# Altium schematic sheet SMA.SchDoc: 8x8 Cross-point
size A3; Author: M.Beldyga; CompanyName: WUT ISE; DrawnBy: M.Beldyga; Organization: WUT ISE; Address1: PW ISE; Address2: Nowowiejska 15/19 00-665 Warsaw; Address3: micbeldyga@gmail.com; SheetNumber: 1; SheetTotal: 1; ModifiedBy: -; CheckedDate: -; Title2: SMA mezzanine; DivGrp: WUT ISE; Designer: M.Beldyga; ModifiedDate: -; ProjectName: Sensor Box
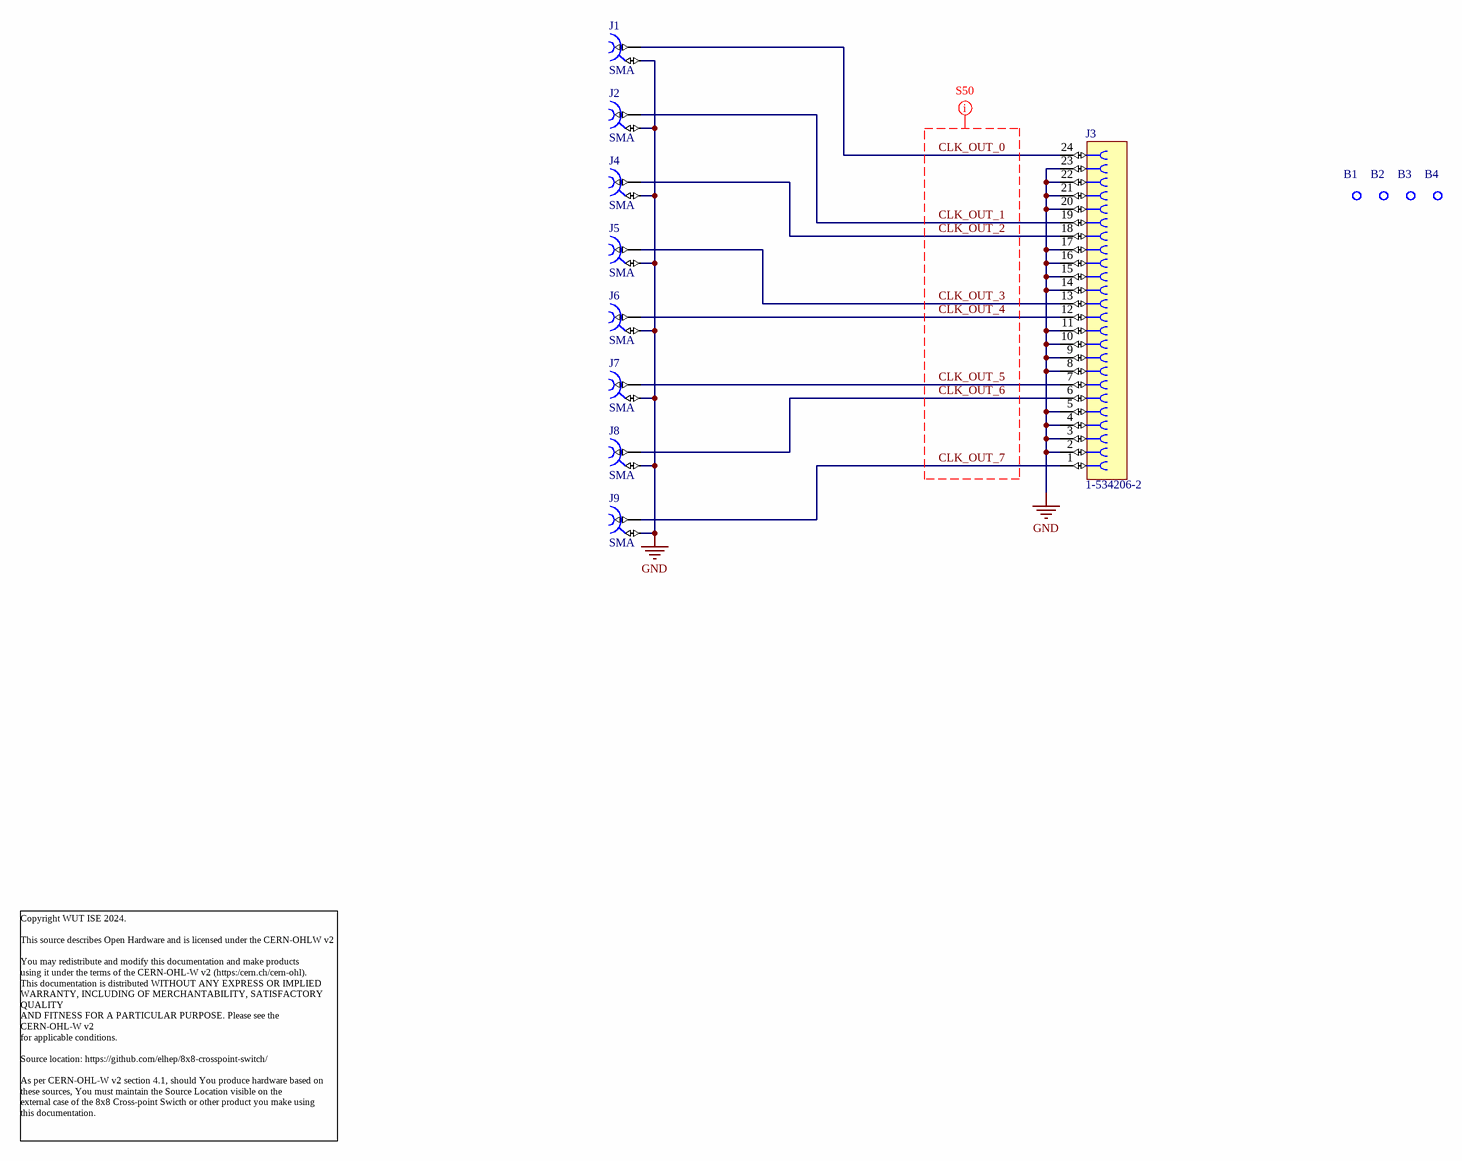
[diagram p0: SMA.SchDoc]

## Parts
B1  Plated Hole  [MTG320_550]  (value not drawn)  (no BOM)
B2  Plated Hole  [MTG320_550]  (value not drawn)  (no BOM)
B3  Plated Hole  [MTG320_550]  (value not drawn)  (no BOM)
B4  Plated Hole  [MTG320_550]  (value not drawn)  (no BOM)
J1  SMA  [AMPHENOL_132203-12]
J2  SMA  [MOLEX_73251-2120]
J3  1-534206-2  [1-534206-2]
J4  SMA  [AMPHENOL_132203-12]
J5  SMA  [MOLEX_73251-2120]
J6  SMA  [AMPHENOL_132203-12]
J7  SMA  [MOLEX_73251-2120]
J8  SMA  [AMPHENOL_132203-12]
J9  SMA  [MOLEX_73251-2120]

## Nets
GND: J1.2 J2.2 J3.2 J3.3 J3.4 J3.5 J3.8 J3.9 J3.10 J3.11 J3.14 J3.15 J3.16 J3.17 J3.20 J3.21 J3.22 J3.23 J4.2 J5.2 J6.2 J7.2 J8.2 J9.2
CLK_OUT_0: J1.1 J3.24
CLK_OUT_1: J2.1 J3.19
CLK_OUT_2: J3.18 J4.1
CLK_OUT_3: J3.13 J5.1
CLK_OUT_4: J3.12 J6.1
CLK_OUT_5: J3.7 J7.1
CLK_OUT_6: J3.6 J8.1
CLK_OUT_7: J3.1 J9.1

Not connected (* = marked no-connect by the designer): B1 1; B2 1; B3 1; B4 1

## Layout directives
net class S50; net class CLK_OUT: CLK_OUT_0, CLK_OUT_1, CLK_OUT_2, CLK_OUT_3, CLK_OUT_4, CLK_OUT_5, CLK_OUT_6, CLK_OUT_7

## Notes on the sheet
- Copyright WUT ISE 2024.
  This source describes Open Hardware and is licensed under the CERN-OHLW v2
  You may redistribute and modify this documentation and make products
  using it under the terms of the CERN-OHL-W v2 (https:/cern.ch/cern-ohl).
  This documentation is distributed WITHOUT ANY EXPRESS OR IMPLIED
  WARRANTY, INCLUDING OF MERCHANTABILITY, SATISFACTORY QUALITY
  AND FITNESS FOR A PARTICULAR PURPOSE. Please see the CERN-OHL-W v2
  for applicable conditions.
  Source location: https://github.com/elhep/8x8-crosspoint-switch/
  As per CERN-OHL-W v2 section 4.1, should You produce hardware based on
  these sources, You must maintain the Source Location visible on the
  external case of the 8x8 Cross-point Swicth or other product you make using
  this documentation.
- Project/Equipment
- Document
- Designer
- Drawn by
- Check.by
- Contact
- File
- Last Mod.
- Print Date
- Sheet
- Size
- A3
- of
- Rev

## Library data of the parts
B1-B4 = PLATED_HOLE3.2_PAD5.5: Single Terminal Socket; Part Description: Plated Through Hole: Hole Dia.=3.2mm Pad Dia.=5.5mm; Mounted: No; Part Number: PLATED_HOLE3.2_PAD5.5; Component Type: Standard (No BOM); Pin Count: 1; Family: Plated Hole; Socket: No; SMD: No; Sense: No; Status: None; ComponentHeight: 0mm; HelpURL: Undefined; Author: CERN DEM JMW; CreateDate: 10/1/2012; LatestRevisionDate: 10/1/2012; PackageDescription: Plated Through Hole: Hole Dia.=3.2mm Pad Dia.=5.5mm
J1 J4 J6 J8 = 132203-12: RF Connector SMA Right Angle PCB Jack Through Hole 50 Ohm Bulkhead; Manufacturer: Amphenol Connex; Supplier: Mouser; Supplier Part Number: 523-132203-12; Manufacturer Part Number: 132203-12; RoHS: Yes; Category: RF / Coaxial Connectors; Stock: 515; Pricing: 1=20.22, 10=18.65, 50=18.65, 100=18.65, 1000=18.65, 10000=18.65 (USD); ComponentLink1URL: https://datasheet.ciiva.com/24241/132203-12-customer-drawing-24241088.pdf?src-supplier=Mouser; ComponentLink1Description: https://datasheet.ciiva.com/24241/132203-12-customer-drawing-24241088.pdf?src-supplier=Mouser; ComponentLink2URL: https://datasheet.ciiva.com/647/132203-12-647032.pdf?src-supplier=Digikey; ComponentLink2Description: https://datasheet.ciiva.com/647/132203-12-647032.pdf?src-supplier=Digikey
J2 J5 J7 J9 = CON_SMA_RA_SMD_73251-2120: 50 Ohm, SMA Edge Mount PCB, With Jam Nut And Lock Washer; Manufacturer: MOLEX; PressFit: No; Part Number: MOLEX_73251-2120; Component Kind: Standard; Component Type: Standard; Pin Count: 5; Family: SMA; Mounted: Yes; Socket: No; SMD: Yes; Sense: No; Status: None; Part Description: 50 Ohm, SMA Edge Mount PCB, With Jam Nut And Lock Washer; Manufacturer Part Number: 73251-2120; ComponentHeight: 5.75mm; HelpURL: \\cern.ch\dfs\Applications\Altium\Datasheets\MOLEX_73251-2121.pdf; Author: CERN DEM JLC; CreateDate: 26.10.2016; LatestRevisionDate: 26.10.2016
J3 = 1-534206-2: Conn Socket Strip SKT 24 POS 2.54mm Solder ST Thru-Hole Automotive Box/Tube; Manufacturer: TE Connectivity; Number of Positions: 24; Gender: Female; Connector Type: Receptacle,Connector,Socket; Contact Resistance: 12MR; Current Rating: 2A; Boss: No (Without); High Temperature Compatible: No; Insulation Resistance: 5GR; PCB Mount Retention: Without; PCB Mounting Orientation: Vertical; Stackable: Yes; Voltage Rating: 250V; Row Spacing: 0.1inch; PCB Thickness: 1.57mm; Tail Length: 2.92mm; Approvals: CSA; Supplier: Mouser; Supplier Part Number: 571-15342062; Manufacturer Part Number: 1-534206-2; RoHS: No; Category: Board to Board Connectors; Stock: 292; Pricing: 1=5.45, 10=5.44, 50=5.1, 100=5.1, 1000=4.71, 10000=4.71 (USD); Mounting Technology: Through Hole; Housing Color: Black; Housing Material: Polyester; Contact Plating: Gold,Tin,Lead; Contact Material: Bronze; Contact Shape: Square; Contact Finish - Mating: GOLD; Insulation Color: Black; Insulation Material: Glass; Min Operating Temperature: -65°C; Max Operating Temperature: 105°C; Packaging: Rail/Tube; Series: AMPMODU MOD II; Number of Rows: 2; Contact Type: Female Socket; Termination: Solder; Number of Contacts: 24; Package Quantity: 18; Fastening Type: Pull; Orientation: Straight; Sealable: No (Without); Contact Current Rating: 2A; Length: 30.48mm; Height: 5.03mm; Pitch: 2.54mm; Contact Post Length: 2.92mm; Depth: 5.03mm; Radiation Hardening: No; Lead Free: Contains Lead; Flammability Rating: UL94 V-0; RoHS Compliant: No; ELV: Non-Compliant; ComponentLink1URL: https://datasheet.ciiva.com/743/eng-cd-534206-r7-743570.pdf?src-supplier=Digikey; ComponentLink1Description: https://datasheet.ciiva.com/743/eng-cd-534206-r7-743570.pdf?src-supplier=Digikey